# Altium schematic sheet FPGA.SCHDOC
size B
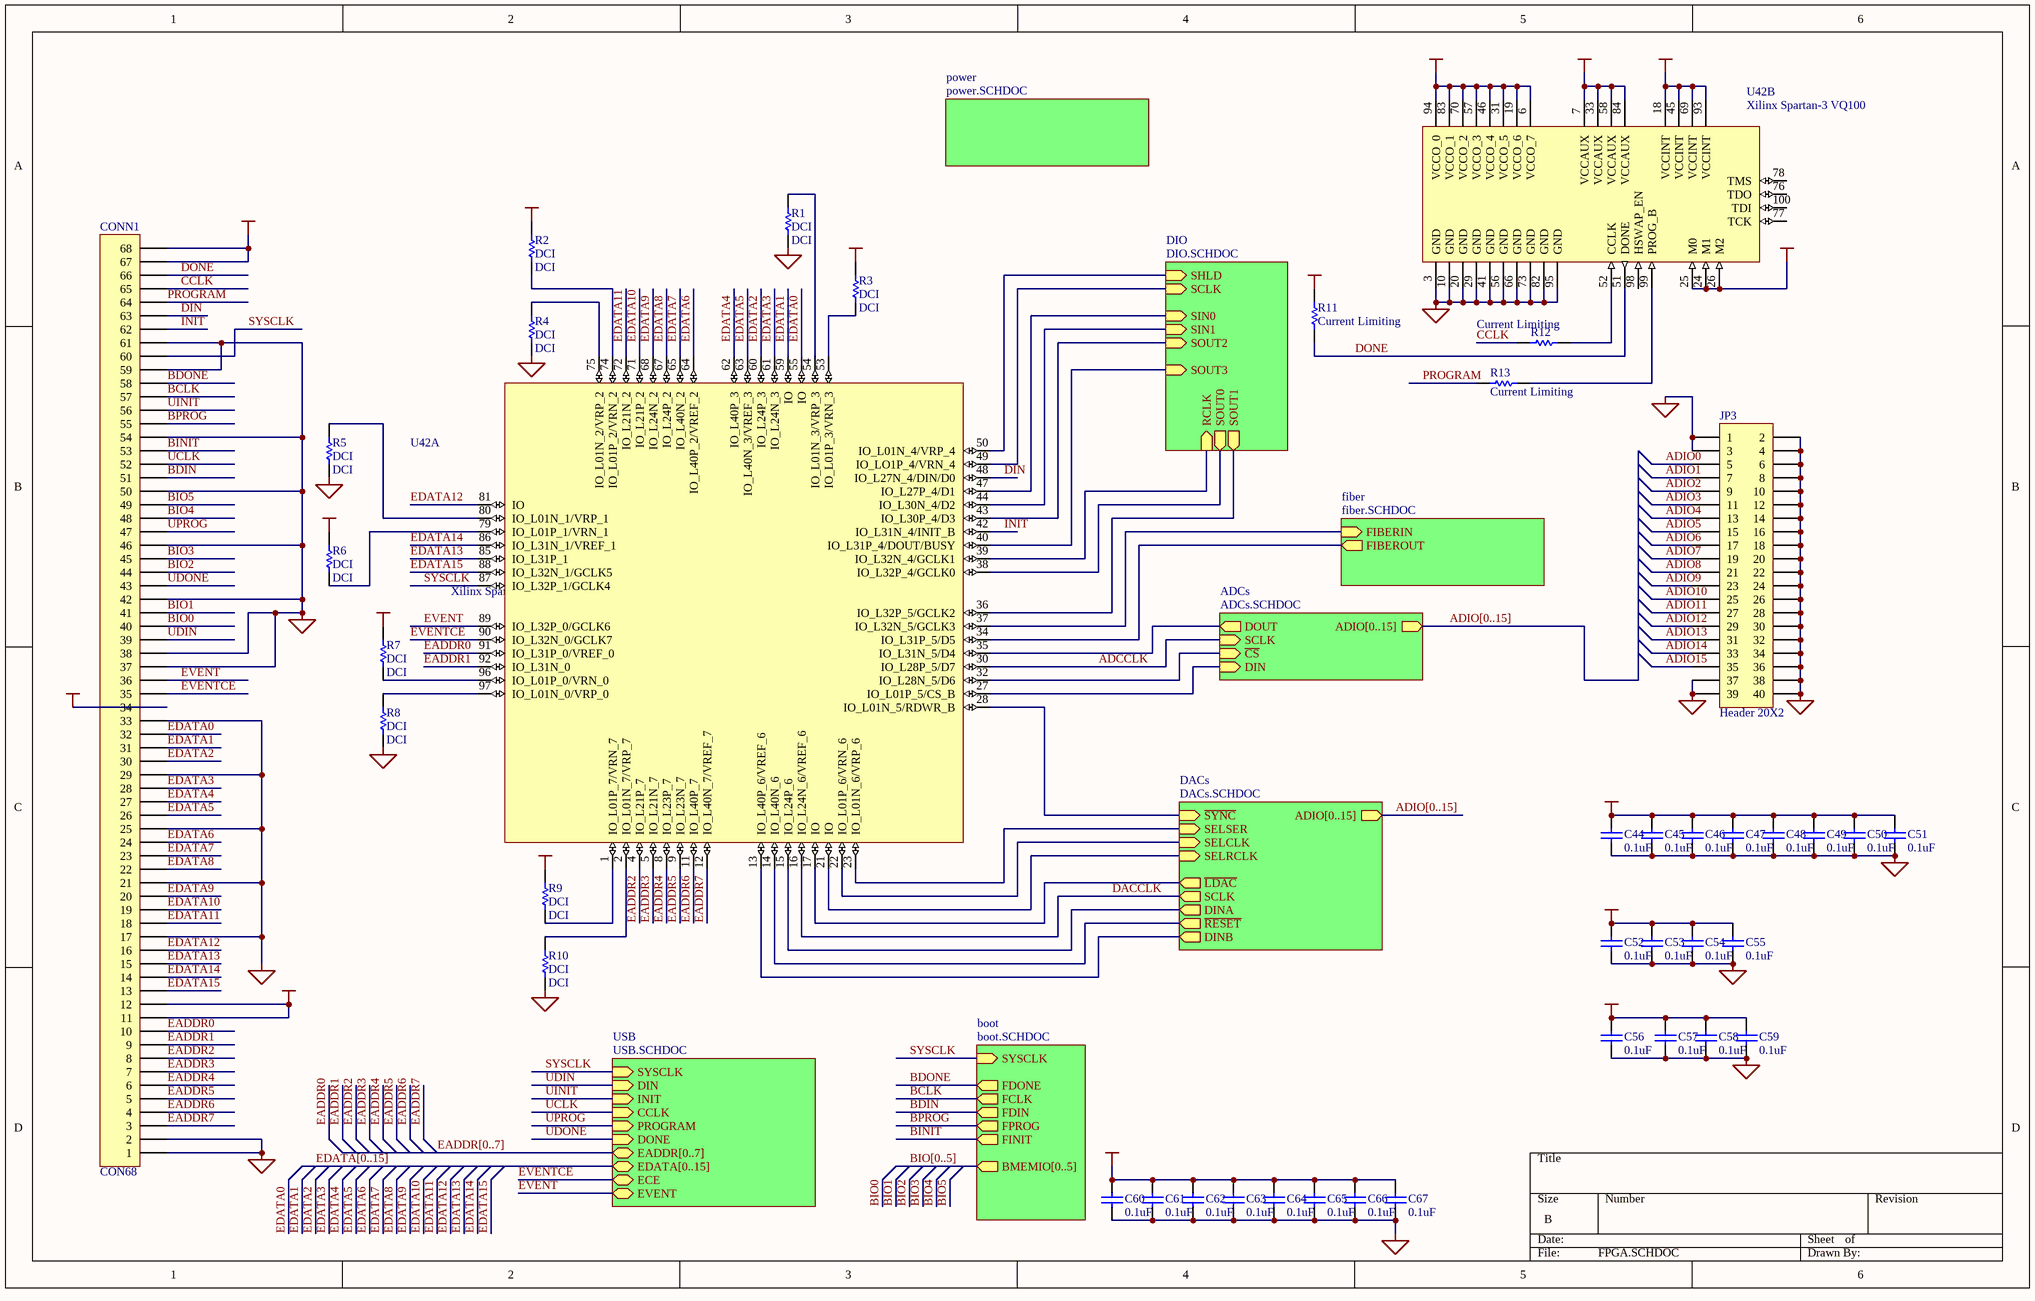
[diagram p0: FPGA.SCHDOC]

## Parts
C44  value 0.1uF  [CC1608-0603]  (hidden comment: Cap)
C45  value 0.1uF  [CC1608-0603]  (hidden comment: Cap)
C46  value 0.1uF  [CC1608-0603]  (hidden comment: Cap)
C47  value 0.1uF  [CC1608-0603]  (hidden comment: Cap)
C48  value 0.1uF  [CC1608-0603]  (hidden comment: Cap)
C49  value 0.1uF  [CC1608-0603]  (hidden comment: Cap)
C50  value 0.1uF  [CC1608-0603]  (hidden comment: Cap)
C51  value 0.1uF  [CC1608-0603]  (hidden comment: Cap)
C52  value 0.1uF  [CC1608-0603]  (hidden comment: Cap)
C53  value 0.1uF  [CC1608-0603]  (hidden comment: Cap)
C54  value 0.1uF  [CC1608-0603]  (hidden comment: Cap)
C55  value 0.1uF  [CC1608-0603]  (hidden comment: Cap)
C56  value 0.1uF  [CC1608-0603]  (hidden comment: Cap)
C57  value 0.1uF  [CC1608-0603]  (hidden comment: Cap)
C58  value 0.1uF  [CC1608-0603]  (hidden comment: Cap)
C59  value 0.1uF  [CC1608-0603]  (hidden comment: Cap)
C60  value 0.1uF  [CC1608-0603]  (hidden comment: Cap)
C61  value 0.1uF  [CC1608-0603]  (hidden comment: Cap)
C62  value 0.1uF  [CC1608-0603]  (hidden comment: Cap)
C63  value 0.1uF  [CC1608-0603]  (hidden comment: Cap)
C64  value 0.1uF  [CC1608-0603]  (hidden comment: Cap)
C65  value 0.1uF  [CC1608-0603]  (hidden comment: Cap)
C66  value 0.1uF  [CC1608-0603]  (hidden comment: Cap)
C67  value 0.1uF  [CC1608-0603]  (hidden comment: Cap)
CONN1  CON68  [MOLEX 71661-2068]
JP3  Header 20X2  [HDR2X20]
R1  DCI  [CC1608-0603]
R2  DCI  [CC1608-0603]
R3  DCI  [CC1608-0603]
R4  DCI  [CC1608-0603]
R5  DCI  [CC1608-0603]
R6  DCI  [CC1608-0603]
R7  DCI  [CC1608-0603]
R8  DCI  [CC1608-0603]
R9  DCI  [CC1608-0603]
R10  DCI  [CC1608-0603]
R11  Current Limiting  [CC1608-0603]
R12  Current Limiting  [CC1608-0603]
R13  Current Limiting  [CC1608-0603]
U42  Xilinx Spartan-3 VQ100  [F-QFP14X14-G100/N]  (parts A,B of 2)

## Sub-sheets
ADCs = ADCs.SCHDOC: ADIO[0..15] (out), DIN (in), DOUT (out), ~{CS} (in), SCLK (in)
boot = boot.SCHDOC: SYSCLK (in), BMEMIO[0..5] (out), FPROG (out), FDONE (out), FCLK (out), FDIN (out), FINIT (out)
DACs = DACs.SCHDOC: ADIO[0..15] (out), ~{SYNC} (in), ~{LDAC} (out), SCLK (out), DINA (out), ~{RESET} (out), DINB (out), SELSER (in), SELCLK (in), SELRCLK (in)
DIO = DIO.SCHDOC: SOUT0 (out), SOUT1 (out), SHLD (in), SCLK (in), SIN0 (in), SIN1 (in), SOUT2 (in), SOUT3 (in), RCLK (in)
fiber = fiber.SCHDOC: FIBERIN (in), FIBEROUT (out)
power = power.SCHDOC: no entries
USB = USB.SCHDOC: SYSCLK (in), DIN (in), INIT (in), CCLK (in), PROGRAM (in), DONE (in), EADDR[0..7] (bidir), EDATA[0..15] (bidir), ECE (bidir), EVENT (bidir)

## Nets
+1.2VCC: C52.1 C53.1 C54.1 C55.1 U42.18(VCCINT) U42.45(VCCINT) U42.69(VCCINT) U42.93(VCCINT)
+2.5VCC: C56.1 C57.1 C58.1 C59.1 U42.7(VCCAUX) U42.33(VCCAUX) U42.58(VCCAUX) U42.84(VCCAUX)
+5VCC: C60.2 C61.2 C62.2 C63.2 C64.2 C65.2 C66.2 C67.2 CONN1.34
GND: C44.2 C45.2 C46.2 C47.2 C48.2 C49.2 C50.2 C51.2 C52.2 C53.2 C54.2 C55.2 C56.2 C57.2 C58.2 C59.2 C60.1 C61.1 C62.1 C63.1 C64.1 C65.1 C66.1 C67.1 CONN1.1 CONN1.2 CONN1.17 CONN1.21 CONN1.25 CONN1.29 CONN1.33 CONN1.37 CONN1.38 CONN1.42 CONN1.46 CONN1.50 CONN1.54 CONN1.59 CONN1.61 JP3.1 JP3.2 JP3.3 JP3.4 JP3.6 JP3.8 JP3.10 JP3.12 JP3.14 JP3.16 JP3.18 JP3.20 JP3.22 JP3.24 JP3.26 JP3.28 JP3.30 JP3.32 JP3.34 JP3.36 JP3.37 JP3.38 JP3.39 JP3.40 R1.1 R4.1 R5.1 R8.1 R10.1 U42.3(GND) U42.10(GND) U42.20(GND) U42.29(GND) U42.41(GND) U42.56(GND) U42.66(GND) U42.73(GND) U42.82(GND) U42.95(GND)
VCC: C44.1 C45.1 C46.1 C47.1 C48.1 C49.1 C50.1 C51.1 CONN1.11 CONN1.12 CONN1.67 CONN1.68 R2.2 R3.2 R6.2 R7.2 R9.2 R11.2 U42.6(VCCO_7) U42.19(VCCO_6) U42.24(M1) U42.25(M0) U42.26(M2) U42.31(VCCO_5) U42.46(VCCO_4) U42.57(VCCO_3) U42.70(VCCO_2) U42.83(VCCO_1) U42.94(VCCO_0)
ADCCLK: U42.30(IO_L28P_5/D7) ; sheet ADCs/SCLK
ADIO0: JP3.5
ADIO1: JP3.7
ADIO2: JP3.9
ADIO3: JP3.11
ADIO4: JP3.13
ADIO5: JP3.15
ADIO6: JP3.17
ADIO7: JP3.19
ADIO8: JP3.21
ADIO9: JP3.23
ADIO10: JP3.25
ADIO11: JP3.27
ADIO12: JP3.29
ADIO13: JP3.31
ADIO14: JP3.33
ADIO15: JP3.35
BCLK: CONN1.57 ; sheet boot/FCLK
BDIN: CONN1.51 ; sheet boot/FDIN
BDONE: CONN1.58 ; sheet boot/FDONE
BINIT: CONN1.53 ; sheet boot/FINIT
BIO0: CONN1.40
BIO1: CONN1.41
BIO2: CONN1.44
BIO3: CONN1.45
BIO4: CONN1.48
BIO5: CONN1.49
BPROG: CONN1.55 ; sheet boot/FPROG
CCLK: CONN1.65 R12.1
DACCLK: U42.16(IO_L24N_6/VREF_6) ; sheet DACs/SCLK
DIN: CONN1.63 U42.48(IO_L27N_4/DIN/D0)
DONE: CONN1.66 R11.1 U42.51(DONE)
EADDR0: CONN1.10 U42.91(IO_L31P_0/VREF_0)
EADDR1: CONN1.9 U42.92(IO_L31N_0)
EADDR2: CONN1.8 U42.4(IO_L21P_7)
EADDR3: CONN1.7 U42.5(IO_L21N_7)
EADDR4: CONN1.6 U42.8(IO_L23P_7)
EADDR5: CONN1.5 U42.9(IO_L23N_7)
EADDR6: CONN1.4 U42.11(IO_L40P_7)
EADDR7: CONN1.3 U42.12(IO_L40N_7/VREF_7)
EDATA0: CONN1.32 U42.55(IO)
EDATA1: CONN1.31 U42.59(IO)
EDATA2: CONN1.30 U42.60(IO_L24P_3)
EDATA3: CONN1.28 U42.61(IO_L24N_3)
EDATA4: CONN1.27 U42.62(IO_L40P_3)
EDATA5: CONN1.26 U42.63(IO_L40N_3/VREF_3)
EDATA6: CONN1.24 U42.64(IO_L40P_2/VREF_2)
EDATA7: CONN1.23 U42.65(IO_L40N_2)
EDATA8: CONN1.22 U42.67(IO_L24P_2)
EDATA9: CONN1.20 U42.68(IO_L24N_2)
EDATA10: CONN1.19 U42.71(IO_L21P_2)
EDATA11: CONN1.18 U42.72(IO_L21N_2)
EDATA12: CONN1.16 U42.81(IO)
EDATA13: CONN1.15 U42.85(IO_L31P_1)
EDATA14: CONN1.14 U42.86(IO_L31N_1/VREF_1)
EDATA15: CONN1.13 U42.88(IO_L32N_1/GCLK5)
EVENT: CONN1.36 U42.89(IO_L32P_0/GCLK6) ; sheet USB/EVENT
EVENTCE: CONN1.35 U42.90(IO_L32N_0/GCLK7) ; sheet USB/ECE
INIT: CONN1.62 U42.42(IO_L31N_4/INIT_B)
PROGRAM: CONN1.64 R13.1
SYSCLK: CONN1.60 U42.87(IO_L32P_1/GCLK4) ; sheet boot/SYSCLK, sheet USB/SYSCLK
UCLK: CONN1.52 ; sheet USB/CCLK
UDIN: CONN1.39 ; sheet USB/DIN
UDONE: CONN1.43 ; sheet USB/DONE
UINIT: CONN1.56 ; sheet USB/INIT
UPROG: CONN1.47 ; sheet USB/PROGRAM
NetR1_2: R1.2 U42.54(IO_L01N_3/VRP_3)
NetR2_1: R2.1 U42.74(IO_L01P_2/VRN_2)
NetR3_1: R3.1 U42.53(IO_L01P_3/VRN_3)
NetR4_2: R4.2 U42.75(IO_L01N_2/VRP_2)
NetR5_2: R5.2 U42.80(IO_L01N_1/VRP_1)
NetR6_1: R6.1 U42.79(IO_L01P_1/VRN_1)
NetR7_1: R7.1 U42.96(IO_L01P_0/VRN_0)
NetR8_2: R8.2 U42.97(IO_L01N_0/VRP_0)
NetR9_1: R9.1 U42.1(IO_L01P_7/VRN_7)
NetR10_2: R10.2 U42.2(IO_L01N_7/VRP_7)
NetR12_2: R12.2 U42.52(CCLK)
NetR13_2: R13.2 U42.99(PROG_B)
NetU42_13: U42.13(IO_L40P_6/VREF_6) ; sheet DACs/DINB
NetU42_14: U42.14(IO_L40N_6) ; sheet DACs/~{RESET}
NetU42_15: U42.15(IO_L24P_6) ; sheet DACs/DINA
NetU42_17: U42.17(IO) ; sheet DACs/~{LDAC}
NetU42_21: U42.21(IO) ; sheet DACs/SELRCLK
NetU42_22: U42.22(IO_L01P_6/VRN_6) ; sheet DACs/SELCLK
NetU42_23: U42.23(IO_L01N_6/VRP_6) ; sheet DACs/SELSER
NetU42_27: U42.27(IO_L01P_5/CS_B) ; sheet ADCs/DIN
NetU42_28: U42.28(IO_L01N_5/RDWR_B) ; sheet DACs/~{SYNC}
NetU42_32: U42.32(IO_L28N_5/D6) ; sheet ADCs/~{CS}
NetU42_34: U42.34(IO_L31P_5/D5) ; sheet fiber/FIBEROUT
NetU42_35: U42.35(IO_L31N_5/D4) ; sheet ADCs/DOUT
NetU42_36: U42.36(IO_L32P_5/GCLK2) ; sheet DIO/SOUT1
NetU42_37: U42.37(IO_L32N_5/GCLK3) ; sheet fiber/FIBERIN
NetU42_38: U42.38(IO_L32P_4/GCLK0) ; sheet DIO/SOUT0
NetU42_39: U42.39(IO_L32N_4/GCLK1) ; sheet DIO/RCLK
NetU42_40: U42.40(IO_L31P_4/DOUT/BUSY) ; sheet DIO/SOUT3
NetU42_43: U42.43(IO_L30P_4/D3) ; sheet DIO/SOUT2
NetU42_44: U42.44(IO_L30N_4/D2) ; sheet DIO/SIN1
NetU42_47: U42.47(IO_L27P_4/D1) ; sheet DIO/SIN0
NetU42_49: U42.49(IO_LO1P_4/VRN_4) ; sheet DIO/SCLK
NetU42_50: U42.50(IO_L01N_4/VRP_4) ; sheet DIO/SHLD

Not connected (* = marked no-connect by the designer): U42 76(TDO) 77(TCK) 78(TMS) 98(HSWAP_EN) 100(TDI)

## Buses and harness runs
bus ADIO[0..15] = sheet ADCs/ADIO[0..15]
bus ADIO[0..15] = sheet DACs/ADIO[0..15]
bus BIO[0..5] = sheet boot/BMEMIO[0..5]
bus EADDR[0..7] = sheet USB/EADDR[0..7]
bus EDATA[0..15] = sheet USB/EDATA[0..15]

## Library data of the parts
C44-C67 = Cap: Capacitor; Manufacturer: Generic Components; Class I: Passive; Published: 8-Jun-2000; Revision: July-2002: Re-released for DXP Platform.; Publisher: Altium Limited; Class II: Capacitor
JP3 = Header 20X2: Header, 20-Pin, Dual row; Manufacturer: Generic Components; Class I: Connector; Revision: July-2002: Re-released for DXP Platform.; Publisher: Altium Limited
R1-R10 = Res1: Resistor; Manufacturer: Generic Components; Class I: Passive; Published: 8-Jun-2000; Revision: July-2002: Re-released for DXP Platform.; Publisher: Altium Limited; Class II: Resistor; Value: DCI
R11-R13 = Res1: Resistor; Manufacturer: Generic Components; Class I: Passive; Value: 1K; Published: 8-Jun-2000; Revision: July-2002: Re-released for DXP Platform.; Publisher: Altium Limited; Class II: Resistor
U42 = XC3S50-VQ100